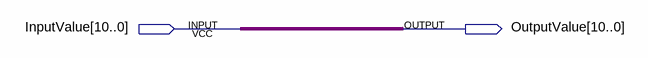
[diagram p0: schematic sheet]
// Quartus schematic Transfer10Bits.bdf as structural Verilog: 0 symbols, 2 pins
module Transfer10Bits (
  input  [10:0] InputValue,
  output [10:0] OutputValue
);


  assign OutputValue = InputValue;
endmodule
